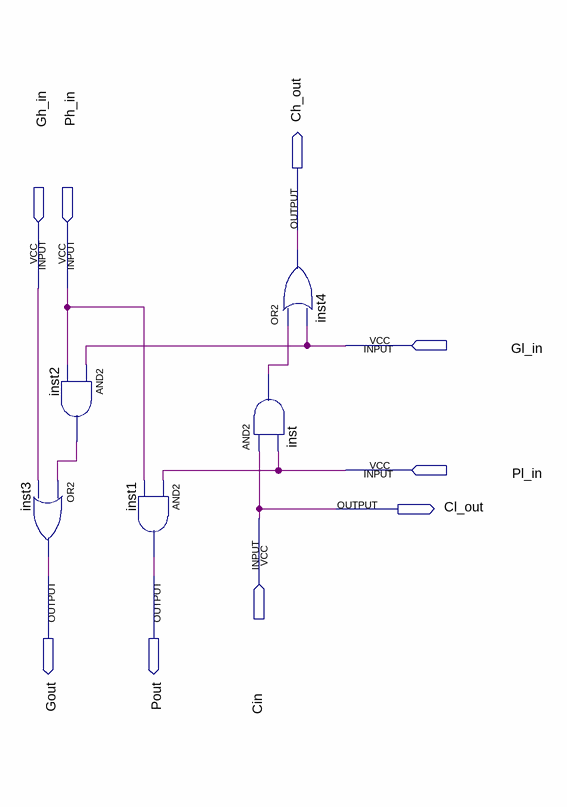
[diagram p0: schematic sheet]
// Quartus schematic blockY.bdf as structural Verilog: 5 symbols, 9 pins
module blockY (
  input  Gh_in,
  input  Ph_in,
  input  Gl_in,
  input  Pl_in,
  input  Cin,
  output Ch_out,
  output Cl_out,
  output Gout,
  output Pout
);

  wire inst2_out, inst_out;

  or inst3 (Gout, inst2_out, Gh_in);
  and inst2 (inst2_out, Gl_in, Ph_in);
  and inst1 (Pout, Pl_in, Ph_in);
  or inst4 (Ch_out, inst_out, Gl_in);
  and inst (inst_out, Cin, Pl_in);

  assign Cl_out = Cin;
endmodule
